# EasyEDA schematic SCH_VS_ALPHA_2024-07-11.json
TITLE: VS Alpha 1; REV: 1.0; Date: 2024-07-08; Sheet: 1/1; Drawn By: aditz26; Company: Your Company
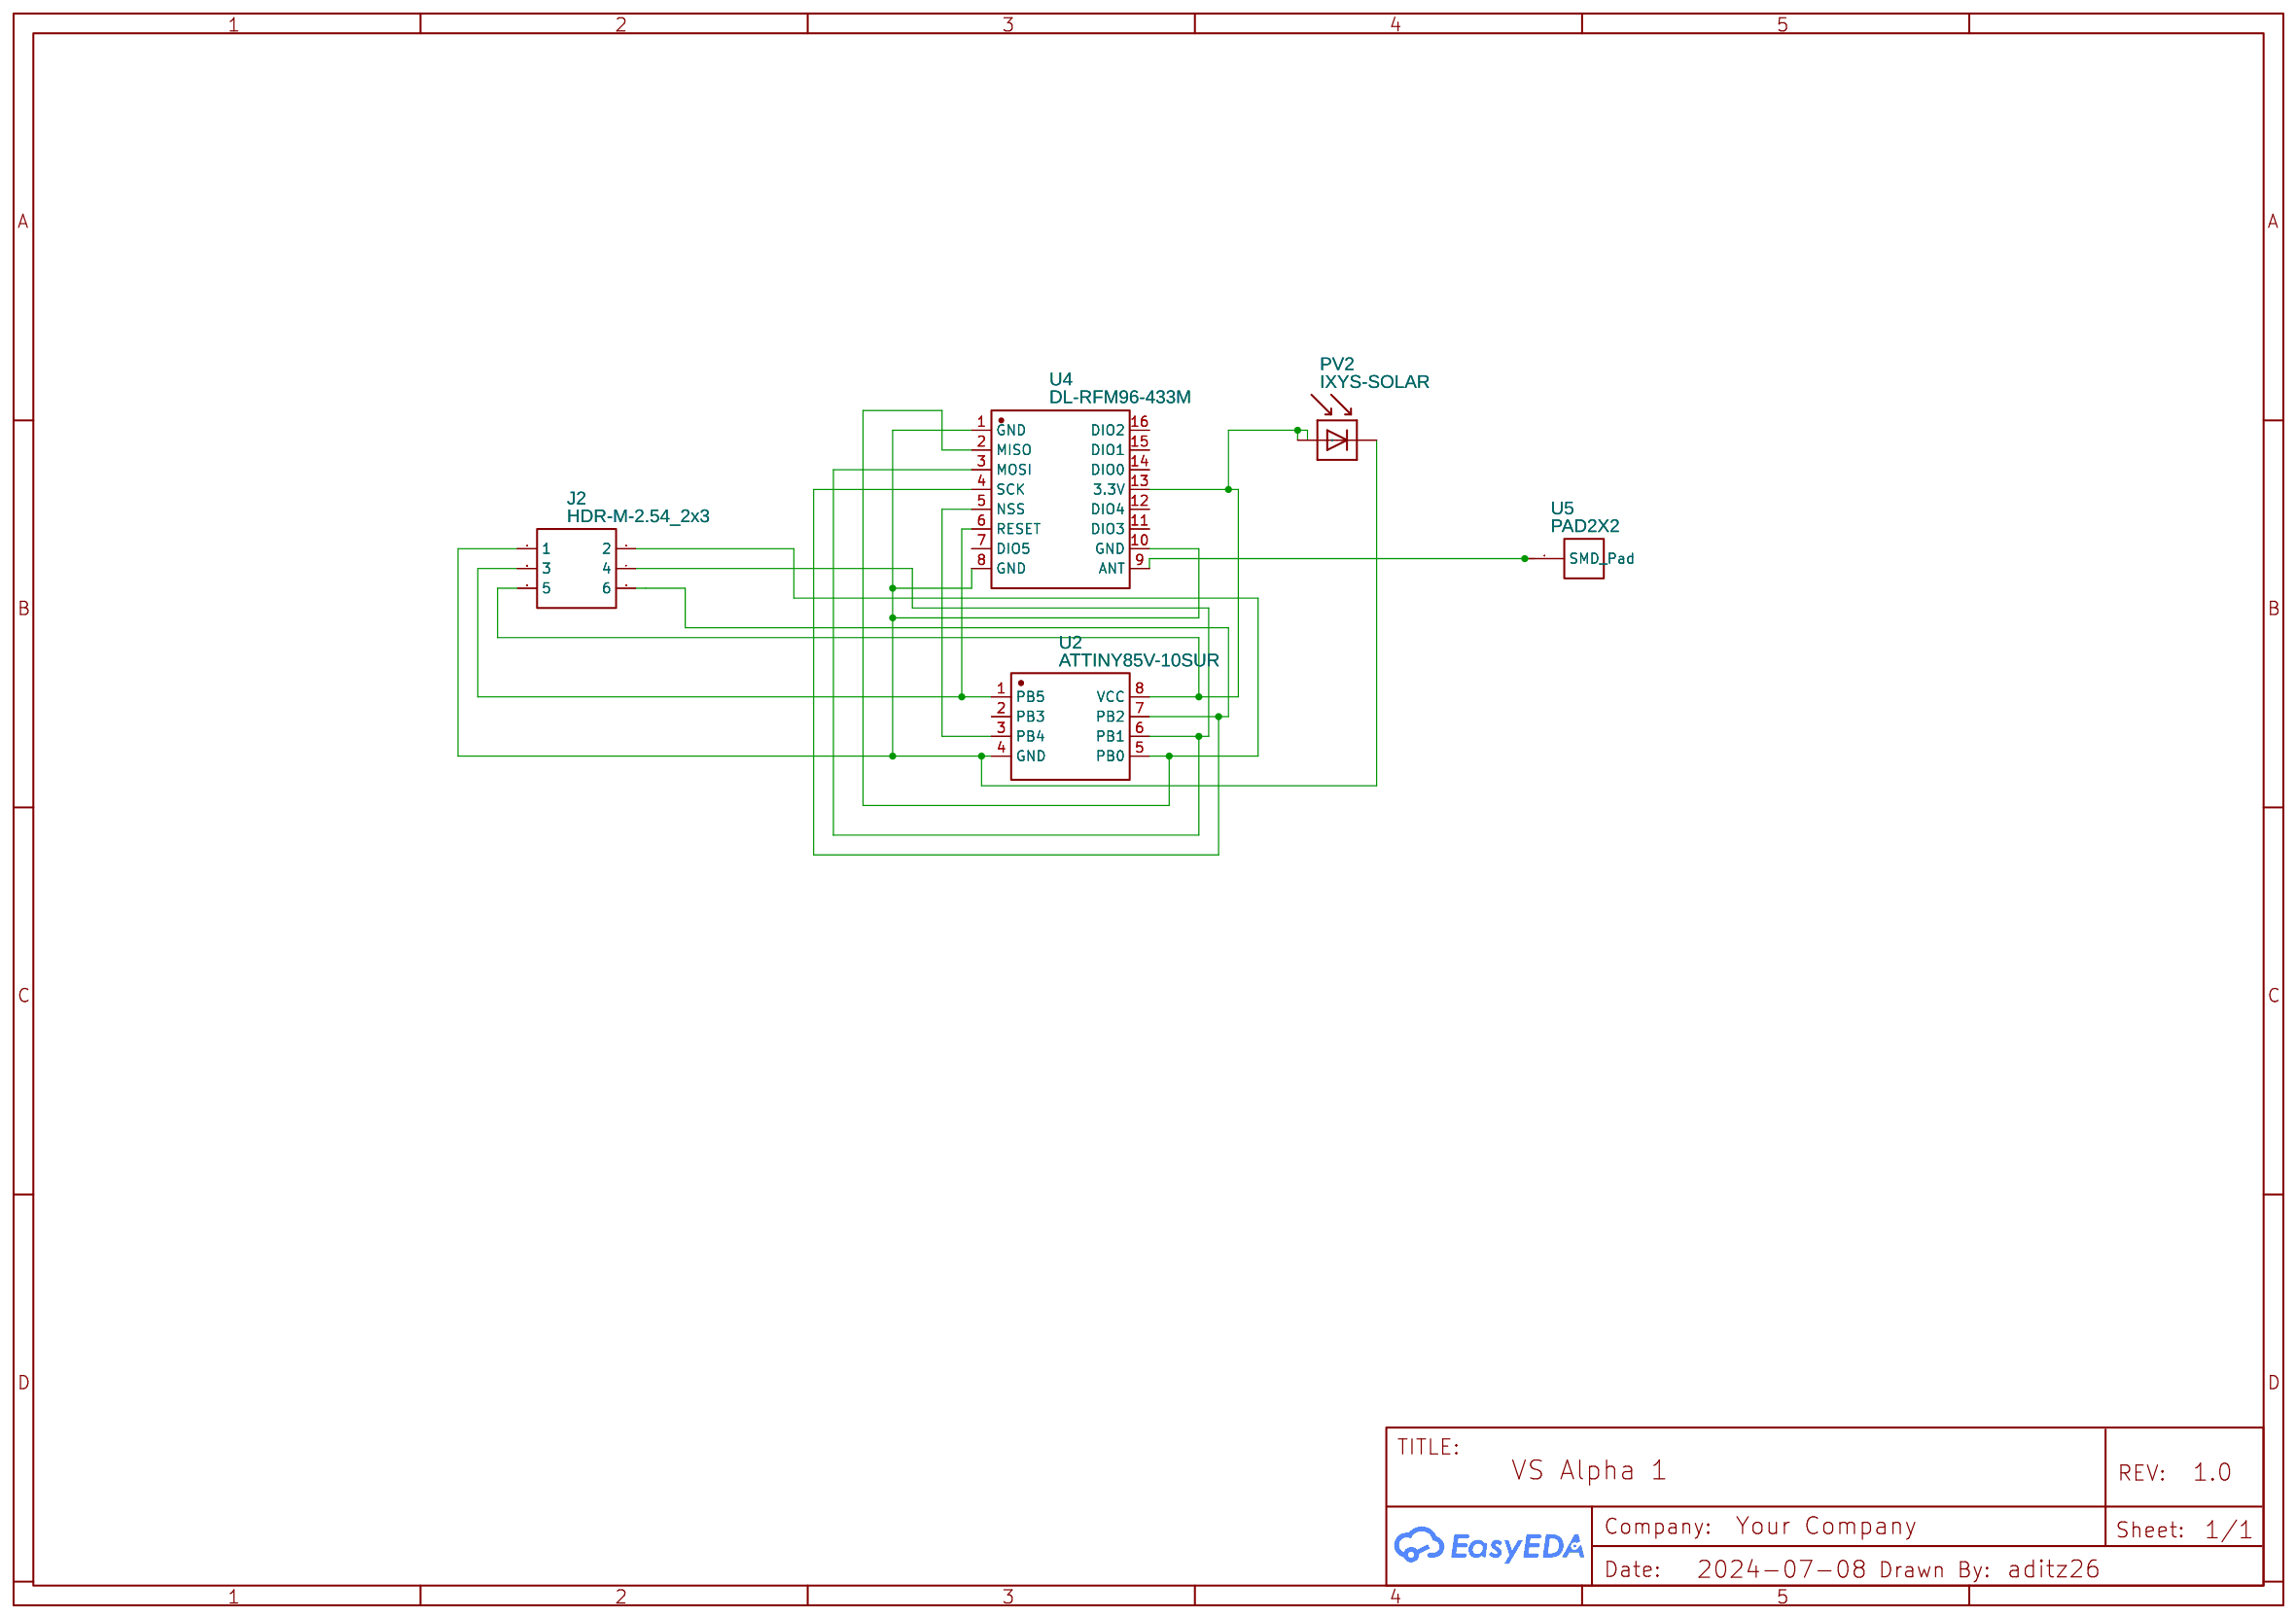
[diagram p0: schematic sheet]

## Parts
J2  HDR-M-2.54_2x3  [HDR-M-2.54_2X3]
PV2  IXYS-SOLAR  [IXYS-SOLAR]
U2  ATTINY85V-10SUR  [SOIC-8_L5.3-W5.3-P1.27-LS8.0-BL]
U4  DL-RFM96-433M  [COMM-SMD_RFM95W]
U5  PAD2X2  [PADPAD]

## Library data of the parts
J2 = HDR-M-2.54_2x3: Supplier Part: C65114; Supplier: LCSC; Contributor: LCEDA_Lib
PV2 = IXYS-SOLAR: Contributor: maseratiolli
U2 = ATTINY85V-10SUR: Contributor: LCSC; Supplier: LCSC; Supplier Part: C616065; Manufacturer: MICROCHIP(美国微芯); JLCPCB Part Class: Extended Part
U4 = DL-RFM96-433M: Supplier: LCSC; Supplier Part: C2844474; Manufacturer: DreamLNK(骏晔科技); JLCPCB Part Class: Extended Part; Contributor: lcsc
U5 = PAD2X2: Contributor: f Beltran

## Nets
Net-(J2-1): J2.1 PV2.-(C) U2.4(GND) U4.1(GND) U4.8(GND) U4.10(GND)
Net-(J2-2): J2.2 U2.5(PB0) U4.2(MISO)
Net-(J2-3): J2.3 U2.1(PB5) U4.6(RESET)
Net-(J2-4): J2.4 U2.6(PB1) U4.3(MOSI)
Net-(J2-5): J2.5 PV2.+(A) U2.8(VCC) U4.13(3.3V)
Net-(J2-6): J2.6 U2.7(PB2) U4.4(SCK)
Net-(U2-3): U2.3(PB4) U4.5(NSS)
Net-(U4-9): U4.9(ANT) U5.1(SMD Pad)

Not connected (* = marked no-connect by the designer): U2 2(PB3); U4 7(DIO5) 11(DIO3) 12(DIO4) 14(DIO0) 15(DIO1) 16(DIO2)
